# EAGLE design MFP_PCB_2layer_v2 (EAGLE 6.5.0)
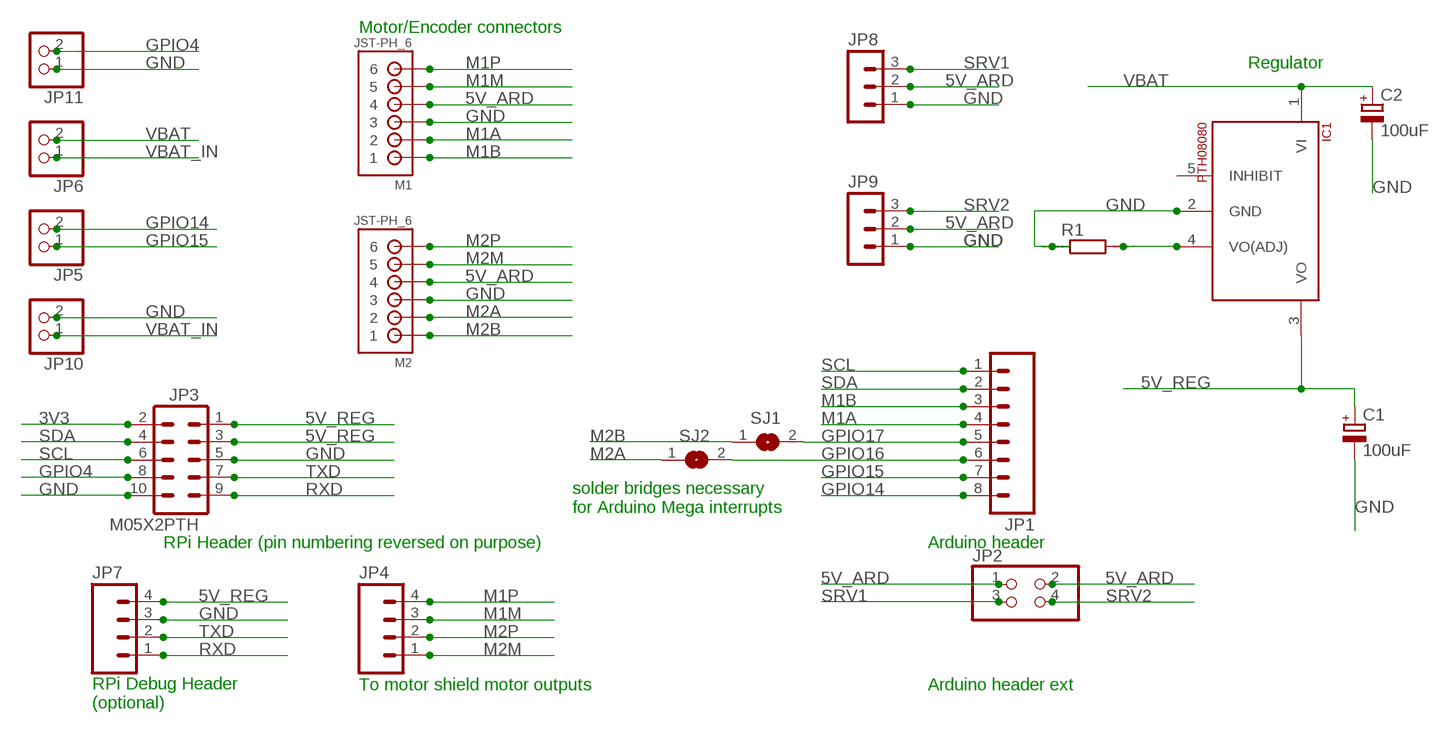
[diagram p0: schematic, sheet 1]

## Parts
C1  100uF  CPOL-EU150CLZ-0810  [150CLZ-0810]
C2  100uF  CPOL-EU150CLZ-0810  [150CLZ-0810]
IC1  PTH08080  [PTH08080]
JP1  M08LONGPADS  [1X08_LONGPADS]
JP2  PINHD-2X2  [2X02]
JP3  M05X2PTH  [AVR_ICSP]
JP4  M04PTH  [1X04]
JP5  PINHD-1X2  [1X02]
JP6  PINHD-1X2  [1X02]
JP7  M04PTH  [1X04]
JP8  MA03-1  [MA03-1]
JP9  MA03-1  [MA03-1]
JP10  PINHD-1X2  [1X02]
JP11  PINHD-1X2  [1X02]
M1  JST-PH_6  [JST_B6B-PH_HEADER]
M2  JST-PH_6  [JST_B6B-PH_HEADER]
R1  R0204/7  [0204/7]
SJ1  SJ  [SJ]
SJ2  SJ  [SJ]

## Nets
3V3: JP3.2
5V_ARD: JP2.1 JP2.2 JP8.2 JP9.2 M1.P4 M2.P4
5V_REG: C1.+ IC1.3(VO) JP3.1 JP3.3 JP7.4
GND: C1.- C2.- IC1.2(GND) JP3.5 JP3.10 JP7.3 JP8.1 JP9.1 JP10.2 JP11.1 M1.P3 M2.P3 R1.1
GPIO4: JP3.8 JP11.2
GPIO14: JP1.8 JP5.2
GPIO15: JP1.7 JP5.1
GPIO16: JP1.6 SJ2.2
GPIO17: JP1.5 SJ1.2
M1A: JP1.4 M1.P2
M1B: JP1.3 M1.P1
M1M: JP4.3 M1.P5
M1P: JP4.4 M1.P6
M2A: M2.P2 SJ2.1
M2B: M2.P1 SJ1.1
M2M: JP4.1 M2.P5
M2P: JP4.2 M2.P6
N$4: IC1.4(VO(ADJ)) R1.2
RXD: JP3.9 JP7.1
SCL: JP1.1 JP3.6
SDA: JP1.2 JP3.4
SRV1: JP2.3 JP8.3
SRV2: JP2.4 JP9.3
TXD: JP3.7 JP7.2
VBAT: C2.+ IC1.1(VI) JP6.2
VBAT_IN: JP6.1 JP10.1
Unconnected: IC1.5(INHIBIT)

## Notes on the sheet
- Motor/Encoder connectors
- Regulator
- solder bridges necessary
  for Arduino Mega interrupts
- RPi Header (pin numbering reversed on purpose) | Arduino header
- To motor shield motor outputs | Arduino header ext
- RPi Debug Header
  (optional)

## Library data of the parts
C1 C2 = rcl:CPOL-EU: POLARIZED CAPACITOR, European symbol
IC1 = TexasInstruments:PTH08080
JP1 = SparkFun-Connectors:M08: Header 8 Standard 8-pin 0.1" header. Use with straight break away headers (SKU : PRT-00116), right angle break away headers (PRT-00553), swiss pins (PRT-00743), machine pins (PRT-00117), and female headers (PRT-00115).
JP2 = pinhead:PINHD-2X2: PIN HEADER
JP3 = SparkFun-Connectors:M05X2: Header 5x2 Standard 10-pin dual row 0.1" header. Commonly used with AVR-ISP. Use with Spark Fun Electronics SKU: PRT-00778
JP4 JP7 = SparkFun-Connectors:M04: Header 4 Standard 4-pin 0.1" header. Use with straight break away headers (SKU : PRT-00116), right angle break away headers (PRT-00553), swiss pins (PRT-00743), machine pins (PRT-00117), and female headers (PRT-00115). Molex polarized connector foot print use with SKU : PRT-08231 with associated crimp pins and housings. 1MM SMD Version SKU: PRT-10208
JP5 JP6 JP10 JP11 = pinhead:PINHD-1X2: PIN HEADER
JP8 JP9 = con-lstb:MA03-1: PIN HEADER; OC_FARNELL: unknown; OC_NEWARK: unknown
M1 M2 = SRG:JST-PH_6
R1 = eagle-ltspice:R: RESISTOR, European symbol; SPICEMODEL: NONE; SPICEPREFIX: R
SJ1 SJ2 = jumper:SJ: SMD solder JUMPER

## Board
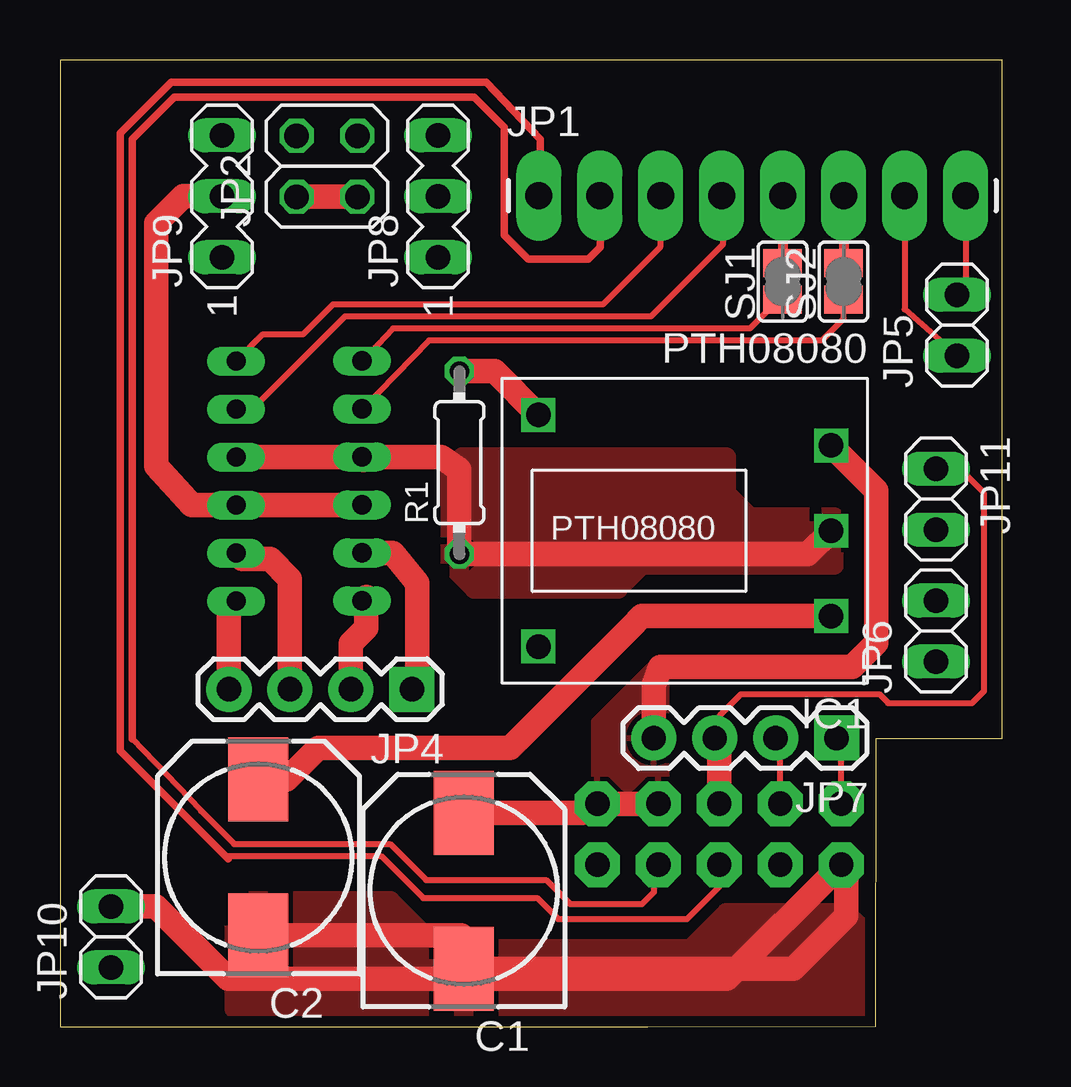
[diagram p1: board, top side]
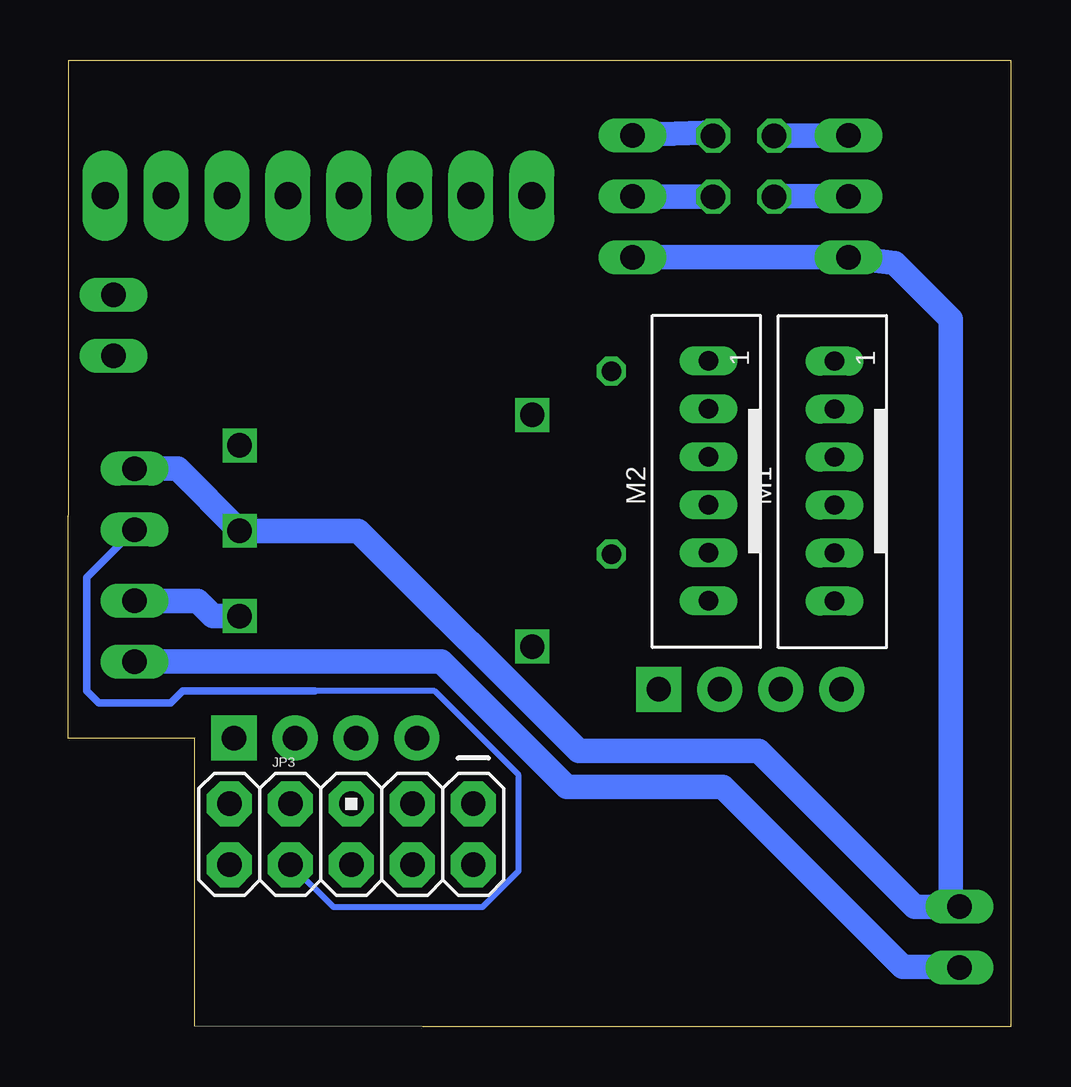
[diagram p2: board, bottom side, seen from below]

Size 39.27 x 40.31 mm. Coordinates in mm from the lower left corner, seen from the top.
Outline: 0,0 24.5,0 33.99,0.03 34.01,12.03 34.01,12.03 39.27,12.03 39.25,30.62 39.25,40.31 0,40.31 0,0
Copper layers (1*16): Top 0.018mm / dielectric 1.55mm / Bottom 0.018mm
Design rules "eC-PCB_proto-2-layer": minimum track width 0.15mm, minimum drill 0.25mm, track to track 0.15mm, track to pad 0.15mm, pad to pad 0.15mm, via to via 0.15mm, smd to smd 0.15mm, copper to edge 0.45mm, drill to drill 0.3mm, minimum pad ring 0.2mm, minimum via ring 0.2mm, stop-mask expansion 0.1mm, vias tented up to drill 0mil, thermal gap 0.2mm

### Footprints (pad centres in the part's own frame; a part is rotated, then mirrored left to right if it is on the bottom)
150CLZ-0810 = smd 3.5 x 2.5: + 3.25,0; - -3.25,0
PTH08080 = drill 1.016 square: 1 -6.096,3.556; 2 -6.096,0; 3 -6.096,-3.556; 4 6.096,-4.826; 5 6.096,4.826
1X08_LONGPADS = drill 1.118 pad 1.88 long: 1 0,0; 2 2.54,0; 3 5.08,0; 4 7.62,0; 5 10.16,0; 6 12.7,0; 7 15.24,0; 8 17.78,0
2X02 = drill 1.016 octagon: 1 -1.27,-1.27; 2 -1.27,1.27; 3 1.27,-1.27; 4 1.27,1.27
AVR_ICSP = drill 1.016 pad 1.88 octagon: 1 -1.27,5.08; 2 1.27,5.08; 3 -1.27,2.54; 4 1.27,2.54; 5 -1.27,0; 6 1.27,0; 7 -1.27,-2.54; 8 1.27,-2.54; 9 -1.27,-5.08; 10 1.27,-5.08
1X04 = drill 1.016 pad 1.88 square: 1 0,0 | drill 1.016 pad 1.88: 2 2.54,0; 3 5.08,0; 4 7.62,0
1X02 = drill 1.016 long: 1 -1.27,0; 2 1.27,0
MA03-1 = drill 1.016 long: 1 -2.54,0; 2 0,0; 3 2.54,0
JST_B6B-PH_HEADER = drill 0.8 long: P1 4,0.048; P2 2,0.048; P3 0,0.048; P4 -2,0.048; P5 -4,0.048; P6 -6,0.048
0204/7 = drill 0.813 octagon: 1 -3.81,0; 2 3.81,0
SJ = smd 1.168 x 1.6: 1 -0.762,0; 2 0.762,0

### Placement (x,y rotation side)
C1  16.83,5.68 90 top
C2  8.27,7.07 90 top
IC1  26.03,20.68 180 top
JP1  19.95,34.66 0 top
JP2  11.12,35.88 90 top
JP3  27.47,8.04 270 bottom
JP4  14.66,14.07 180 top
JP5  37.38,29.25 90 top
JP6  36.5,16.5 90 top
JP7  32.36,12.04 180 top
JP8  15.75,34.62 90 top
JP9  6.75,34.62 90 top
JP10  2.12,3.75 90 top
JP11  36.5,22 270 top
M1  7.29,23.75 90 bottom
M2  12.54,23.77 90 bottom
R1  16.64,23.52 90 top
SJ1  30.11,31.07 90 top
SJ2  32.65,31.07 90 top

### Tracks (layer width: path | path; a pad name or v marks a point on that pad's centre or on a via)
5V_ARD
  Top 1.016: M2.P4 6.85,21.77 | 6.85,21.77 M1.P4 | 6.85,21.77 5.49,21.77 4,23.38 4,33.5 5.12,34.62 JP9.2 | JP2.1 JP2.2
  Bottom 1.016: JP8.2 14.98,34.6 JP2.1 | JP2.2 9.84,34.62 JP9.2
5V_REG
  Top 1.016: C1.+ 21.76,8.94 JP3.1 JP3.3 | IC1.3 34,22.37 34,16 33,15 25,15 24.74,14.26 JP7.4
  pour Top: 25.25,15.25 25.25,9.25 22.25,9.25 22.25,12.75 24.75,15.25
GND
  Top 0.254: 27.47,11.86 JP7.3 | JP3.5 27.5,9.34 27.5,13 28.38,13.88 34.12,13.88 34.5,13.5 38,13.5 38.5,14 38.5,22.25 37.48,23.27 JP11.1
  Top 1.016: JP3.5 27.47,11.86 | IC1.2 31.16,19.71 R1.1 16.64,23.23 15.88,23.75 13.07,23.75 M2.P3 12.64,23.64 11.62,23.75 M1.P3 | C2.- 16.71,3.81 C1.- 30.56,2.44 32.75,4.62 32.75,6.57 JP3.10 27.79,2 7,2 3.98,5.02 JP10.2
  Bottom 1.016: JP11.1 34.71,23.27 IC1.2 27.18,20.68 18,11.5 10.5,11.5 4,5 2.15,5 JP10.2 2.5,5.39 2.5,29.5 4.83,31.84 JP9.1 JP8.1 16.12,32.09
  pour Top: 32.25,19.25 32.25,21.25 28.75,21.25 27.75,22.25 27.75,23.75 16.75,23.75 16.25,23.25 16.25,19.25 17.25,18.25 23.25,18.25 24.25,19.25
  pour Top: 7.25,5.25 7.25,0.75 33.25,0.75 33.25,4.25 32.75,4.75 27.75,4.75 26.25,3.25 15.75,3.25 13.75,5.25
GPIO4
  Bottom 0.254: 29.98,6.76 28.22,5 22,5 20.5,6.5 20.5,10.5 24,14 29,14
  Bottom 0.305: JP11.2 38.5,18.73 38.5,14 38,13.5 35,13.5 34.5,14 29,14 | 29.98,6.76 JP3.8
GPIO14
  Top 0.254: JP1.8 37.73,30.91 JP5.2
GPIO15
  Top 0.254: JP1.7 35.19,29.91 JP5.1
GPIO16
  Top 0.406: JP1.6 SJ2.2
GPIO17
  Top 0.406: JP1.5 SJ1.2
M1A
  Top 0.254: M1.P2 8,25.75 11.88,29.62 24.62,29.62 27.62,32.62 27.62,34 27.57,34.05 JP1.4
M1B
  Top 0.254: M1.P1 8.46,28.88 10.12,28.88 11.38,30.12 22.62,30.12 25.03,32.53 JP1.3
M1M
  Top 1.016: M1.P5 7.59,19.5 8.75,19.5 9.58,18.67 JP4.3
M1P
  Top 1.016: JP4.4 7.04,17.46 M1.P6
M2A
  Top 0.254: M2.P2 15.38,28.62 31.75,28.62 32.65,29.52 SJ2.1
M2B
  Top 0.254: M2.P1 12.95,28.12 13.88,29.12 28.75,29.12 29.94,30.31 SJ1.1
M2M
  Top 1.016: M2.P5 13.86,19.77 14.88,18.5 14.88,14.79 JP4.1
M2P
  Top 1.016: JP4.2 12.12,15.99 12.75,16.62 12.75,17.93 M2.P6
N$4
  Top 1.016: R1.2 18.11,27.34 IC1.4
RXD
  Top 0.254: JP3.9 32.55,11.86 JP7.1
SCL
  Top 0.254: 6.88,7.12 13.38,7.12 15.12,5.38 19.88,5.38 20.75,4.5 26.12,4.5 27.47,5.84 JP3.6
  Top 0.305: JP1.1 20,35.1 20,37 17.75,39.38 4.62,39.38 2.5,37.25 2.5,11.5 6.88,7.12 7,7
SDA
  Top 0.254: JP3.4 24.75,6.58 24.75,5.62 24.25,5.12 21.25,5.12 20.25,6.12 15.25,6.12 13.75,7.62 7.25,7.62 5.88,9 3,12
  Top 0.305: JP1.2 22.5,34.65 22.5,32.5 22,32 19.5,32 18.5,33 18.5,37.5 17.25,38.75 4.75,38.75 3,37 3,12
SRV1
  Bottom 1.016: JP2.3 12.25,37.29 JP8.3
SRV2
  Bottom 1.016: JP9.3 6.86,37.15 JP2.4
TXD
  Top 0.254: JP3.7 30.01,11.86 JP7.2
VBAT
  Top 1.016: C2.+ 9.44,10.31 10.75,11.62 18.75,11.62 23.75,16.62 24.25,17.12 IC1.1
  Bottom 1.016: JP6.2 36.48,17.75 33.88,17.75 33.25,17.13 IC1.1
VBAT_IN
  Bottom 1.016: JP10.1 2.15,2.5 4.5,2.5 12,10 18.5,10 23.73,15.23 JP6.1